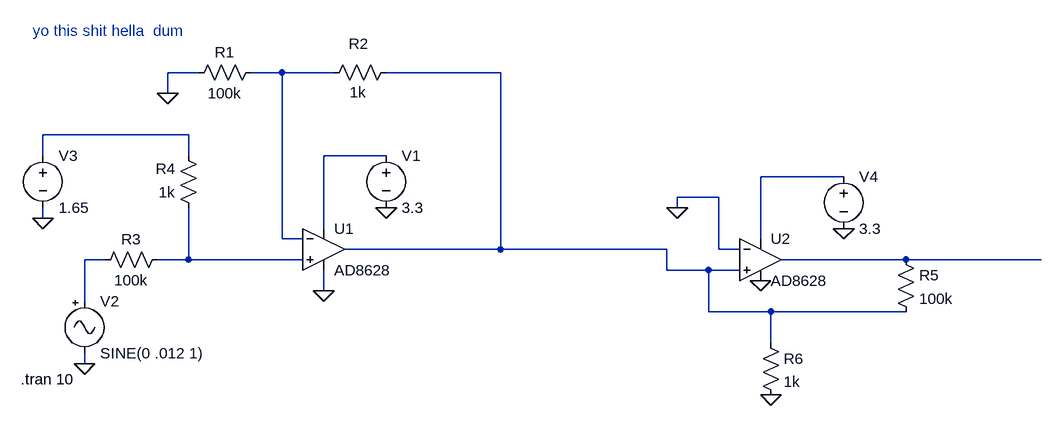
[diagram p0: schematic Level_shifter_opampt.asc]
Level_shifter_opampt.asc, the LTspice schematic file:
Version 4
SHEET 1 1252 680
WIRE -48 -192 -96 -192
WIRE 80 -192 32 -192
WIRE 160 -192 80 -192
WIRE 416 -192 240 -192
WIRE -96 -160 -96 -192
WIRE -64 -96 -288 -96
WIRE -288 -64 -288 -96
WIRE -64 -64 -64 -96
WIRE 240 -64 144 -64
WIRE 944 -32 816 -32
WIRE 752 0 688 0
WIRE 688 16 688 0
WIRE -288 32 -288 16
WIRE 144 48 144 -64
WIRE 80 64 80 -192
WIRE 112 64 80 64
WIRE 816 64 816 -32
WIRE 416 80 416 -192
WIRE 416 80 176 80
WIRE 672 80 416 80
WIRE 752 80 752 0
WIRE 784 80 752 80
WIRE -192 96 -224 96
WIRE -64 96 -64 16
WIRE -64 96 -112 96
WIRE 112 96 -64 96
WIRE 1040 96 848 96
WIRE 1248 96 1040 96
WIRE 672 112 672 80
WIRE 736 112 672 112
WIRE 784 112 736 112
WIRE 144 144 144 112
WIRE -224 160 -224 96
WIRE 736 176 736 112
WIRE 832 176 736 176
WIRE 1040 176 832 176
WIRE 832 224 832 176
WIRE -224 256 -224 240
FLAG 144 144 0
FLAG 240 16 0
FLAG -224 256 0
FLAG -288 32 0
FLAG -96 -160 0
FLAG 688 16 0
FLAG 944 48 0
FLAG 816 128 0
FLAG 832 304 0
SYMBOL Opamps\\AD8628 144 16 R0
SYMATTR InstName U1
SYMBOL voltage 240 -80 R0
WINDOW 123 0 0 Left 0
WINDOW 39 0 0 Left 0
SYMATTR InstName V1
SYMATTR Value 3.3
SYMBOL res 256 -208 R90
WINDOW 0 -13 58 VBottom 2
WINDOW 3 31 59 VTop 2
SYMATTR InstName R2
SYMATTR Value 1k
SYMBOL res -96 80 R90
WINDOW 0 0 56 VBottom 2
WINDOW 3 32 56 VTop 2
SYMATTR InstName R3
SYMATTR Value 100k
SYMBOL res -48 32 R180
WINDOW 0 36 76 Left 2
WINDOW 3 36 40 Left 2
SYMATTR InstName R4
SYMATTR Value 1k
SYMBOL voltage -288 -80 R0
WINDOW 123 0 0 Left 0
WINDOW 39 0 0 Left 0
SYMATTR InstName V3
SYMATTR Value 1.65
SYMBOL Misc\\signal -224 144 R0
WINDOW 123 0 0 Left 0
WINDOW 39 0 0 Left 0
SYMATTR InstName V2
SYMATTR Value SINE(0 .012 1)
SYMBOL res 48 -208 R90
WINDOW 0 0 56 VBottom 2
WINDOW 3 32 56 VTop 2
SYMATTR InstName R1
SYMATTR Value 100k
SYMBOL Opamps\\AD8628 816 32 R0
SYMATTR InstName U2
SYMBOL voltage 944 -48 R0
WINDOW 123 0 0 Left 0
WINDOW 39 0 0 Left 0
SYMATTR InstName V4
SYMATTR Value 3.3
SYMBOL res 1024 80 R0
SYMATTR InstName R5
SYMATTR Value 100k
SYMBOL res 816 208 R0
SYMATTR InstName R6
SYMATTR Value 1k
TEXT -304 -256 Left 2 ;yo this shit hella  dum
TEXT -322 280 Left 2 !.tran 10

The netlist it stands for:
* Level_shifter_opampt.asc
XU1 N007 N001 N004 0 N002 AD8628  ; pins In+ In- V+ V- OUT
V1 N004 0 3.3
R2 N002 N001 1k
R3 N007 N006 100k
R4 N007 N003 1k
V3 N003 0 1.65
V2 N006 0 SINE(0 .012 1)
R1 N001 0 100k
XU2 N002 0 N005 0 N008 AD8628  ; pins In+ In- V+ V- OUT
V4 N005 0 3.3
R5 N008 N002 100k
R6 N002 0 1k
* yo this shit hella  dum
.tran 10
.backanno
.end